# Altium project LSP_PCB_Project.PrjPCB
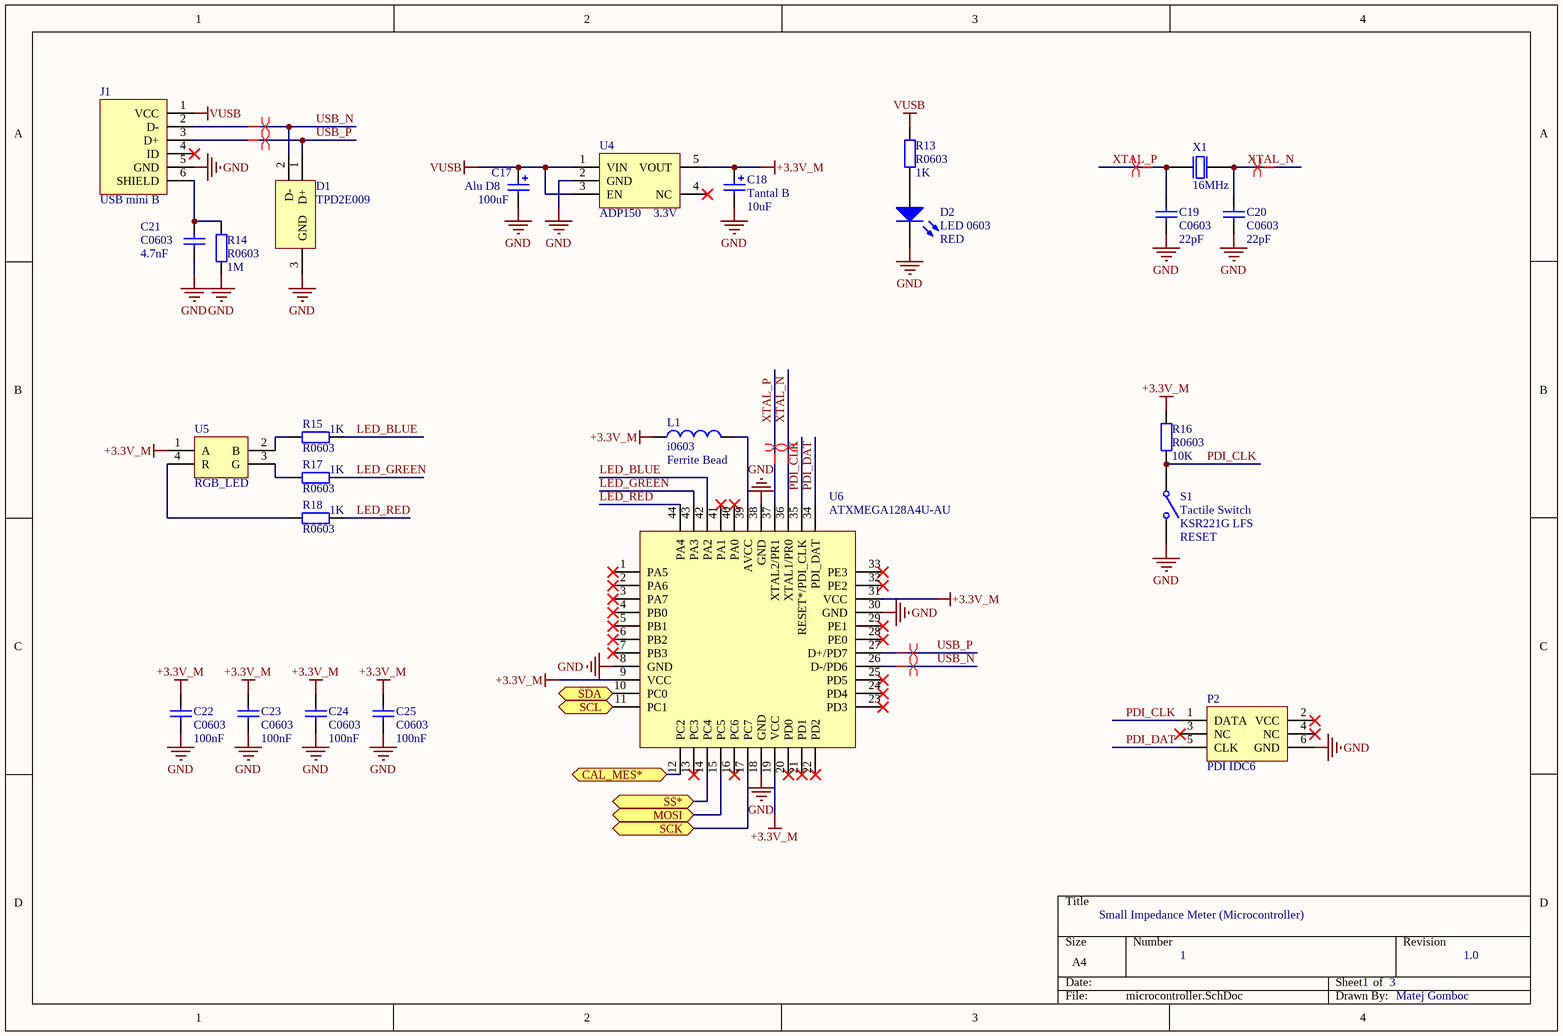
[diagram p0: microcontroller.SchDoc]
3 sheets, 65 parts. Net scope: flat (ports and power ports of the same name join across sheets).
Board file: PCB1.PcbDoc
Sheets:
  microcontroller.SchDoc
  analog.SchDoc
  clk_gen.SchDoc

## Sheet microcontroller.SchDoc: Small Impedance Meter (Microcontroller)
size A4; ApprovedBy: Matej Gomboc; CheckedBy: Matej Gomboc; Author: Matej Gomboc; DrawnBy: Matej Gomboc; Engineer: Matej Gomboc; DocumentNumber: 1; Revision: 1.0; SheetNumber: 1; SheetTotal: 3; DocumentName: Microcontroller; ProjectName: Small Impedance Meter

### Parts
C17  Alu D8  value 100uF  [PANASONIC SIZE D8]
C18  Tantal B  value 10uF  [AVX-CAPC3528_V]
C19  C0603  value 22pF  [0603_HandSoldering]
C20  C0603  value 22pF  [0603_HandSoldering]
C21  C0603  value 4.7nF  [0603_HandSoldering]
C22  C0603  value 100nF  [0603_HandSoldering]
C23  C0603  value 100nF  [0603_HandSoldering]
C24  C0603  value 100nF  [0603_HandSoldering]
C25  C0603  value 100nF  [0603_HandSoldering]
D1  TPD2E009  [TPD2E009_SOT23_3]
D2  LED 0603  value RED  [0603_LED]
J1  USB mini B  [USB mini B receptacle]
L1  i0603  value Ferrite Bead  [0603_HandSoldering]
P2  PDI IDC6  [PDI_HDR2X3]
R13  R0603  value 1K  [0603_HandSoldering]
R14  R0603  value 1M  [0603_HandSoldering]
R15  R0603  value 1K  [0603_HandSoldering]
R16  R0603  value 10K  [0603_HandSoldering]
R17  R0603  value 1K  [0603_HandSoldering]
R18  R0603  value 1K  [0603_HandSoldering]
S1  Tactile Switch  value KSR221G LFS  Note: RESET  [KSR221G_LFS_Tactile_Switch]
U4  ADP150  value 3.3V  [ADP150]
U5  RGB_LED  [PLCC-4_LED]
U6  ATXMEGA128A4U-AU  [ATXMEGAA4U_TQFP44]
X1  16MHz  [XTAL_TH_LOW]

### Ports
CAL_MES*, MOSI, SCK, SCL, SDA, SS*

### Nets
+3.3V_M: C18.1 C22.1 C23.1 C24.1 C25.1 L1.1 R16.2 U4.5(VOUT) U5.1(A) U6.9(VCC) U6.19(VCC) U6.31(VCC)
GND: C17.2 C18.2 C19.1 C20.1 C21.1 C22.2 C23.2 C24.2 C25.2 D1.3(GND) D2.2(K) J1.5(GND) P2.6(GND) R14.1 S1.2(NO) U4.2(GND) U6.8(GND) U6.18(GND) U6.30(GND) U6.38(GND)
VUSB: C17.1 J1.1(VCC) R13.1 U4.1(VIN) U4.3(EN)
LED_BLUE: R15.2 U6.42(PA2)
LED_GREEN: R17.1 U6.43(PA3)
LED_RED: R18.1 U6.44(PA4)
PDI_CLK: P2.1(DATA) R16.1 S1.1(COMMON) U6.35(RESET*/PDI_CLK)
PDI_DAT: P2.5(CLK) U6.34(PDI_DAT)
USB_N: D1.2(D-) J1.2(D-) U6.26(D-/PD6)
USB_P: D1.1(D+) J1.3(D+) U6.27(D+/PD7)
XTAL_N: C20.2 U6.36(XTAL1/PR0) X1.2(out)
XTAL_P: C19.2 U6.37(XTAL2/PR1) X1.1(inp)
NetC21_2: C21.2 J1.6(SHIELD) R14.2
NetD2_1: D2.1(A) R13.2
NetL1_2: L1.2 U6.39(AVCC)
NetR1_1: U6.11(PC1) ; port SCL
NetR2_1: U6.10(PC0) ; port SDA
NetR15_1: R15.1 U5.2(B)
NetR17_2: R17.2 U5.3(G)
NetR18_2: R18.2 U5.4(R)
NetU3_1: U6.12(PC2) ; port CAL_MES*
NetU6_14: U6.14(PC4) ; port SS*
NetU6_15: U6.15(PC5) ; port MOSI
NetU6_17: U6.17(PC7) ; port SCK

Not connected (* = marked no-connect by the designer): J1 4(ID)*; P2 2(VCC)* 3(NC)* 4(NC)*; U4 4(NC)*; U6 1(PA5)* 2(PA6)* 3(PA7)* 4(PB0)* 5(PB1)* 6(PB2)* 7(PB3)* 13(PC3)* 16(PC6)* 20(PD0)* 21(PD1)* 22(PD2)* 23(PD3)* 24(PD4)* 25(PD5)* 28(PE0)* 29(PE1)* 32(PE2)* 33(PE3)* 40(PA0)* 41(PA1)*

### Layout directives
differential pair: USB_N, USB_P, XTAL_N, XTAL_P

### Library data of the parts
C17 = Capacitor Aluminium: Aluminium Electrolythic Capacitor
C18 = Capacitor Tantalum: Tantalum Capacitor
C19-C25 = Capacitor: Ceramic Capacitor
D1 = TPD2E009: ESD protection
D2 = LED: SMD LED 0603
J1 = USB_mini_B: USB 2.0 mini B receptacle
L1 = Inductor
P2 = PDI_Header: PDI Programming Interface
R13-R18 = Resistor
S1 = SW-SPST: KSR221G LFS Tactile Switch
U4 = ADP150: 100 mA Voltage Regulator
U5 = RGB_LED: RGB LED ASMB-MTB0-0A3A2
U6 = ATXMEGA128A4U-AU: 8/16-bit Atmel XMEGA Microcontroller
X1 = XTAL_TH_LOW: XTAL TH Low Profile; Value: 16MHz

## Sheet analog.SchDoc: Small Impedance Meter (Analogue Part)
size A4; ApprovedBy: Matej Gomboc; CheckedBy: Matej Gomboc; Author: Matej Gomboc; DrawnBy: Matej Gomboc; Engineer: Matej Gomboc; DocumentNumber: 2; Revision: 1.0; SheetNumber: 2; SheetTotal: 3; DocumentName: Analogue Part; ProjectName: Small Impedance Meter
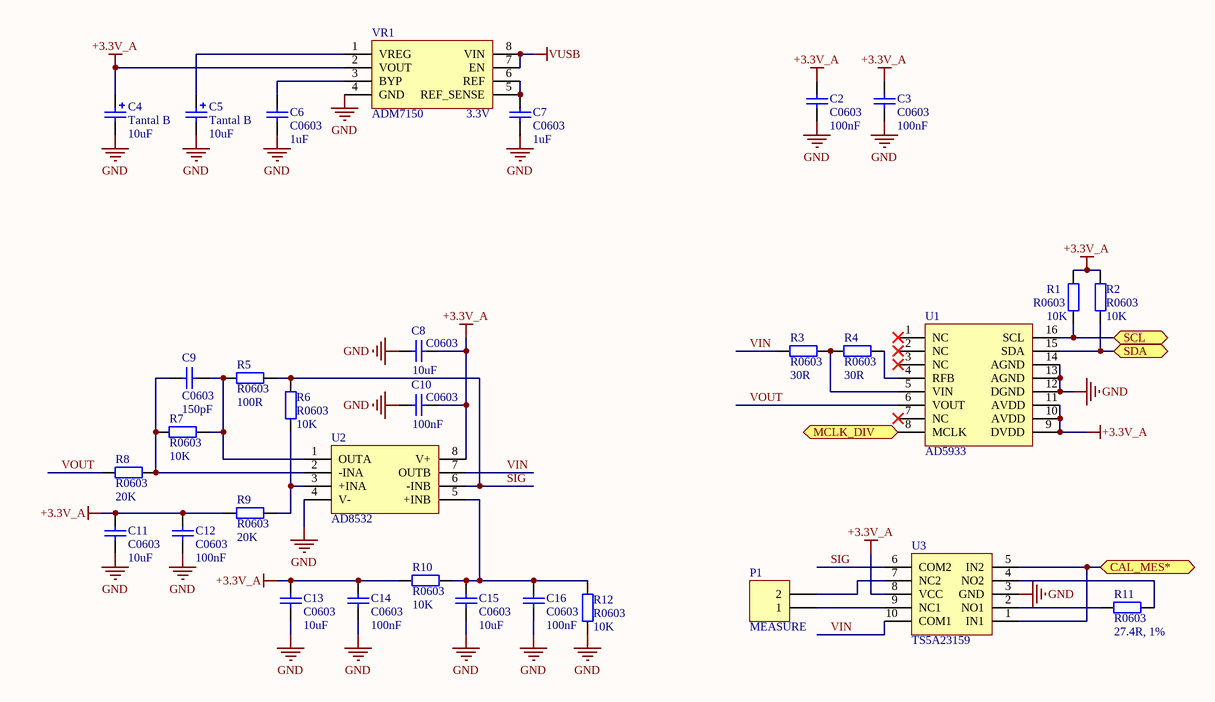
[diagram p1: analog.SchDoc]

### Parts
C2  C0603  value 100nF  [0603_HandSoldering]
C3  C0603  value 100nF  [0603_HandSoldering]
C4  Tantal B  value 10uF  [AVX-CAPC3528_V]
C5  Tantal B  value 10uF  [AVX-CAPC3528_V]
C6  C0603  value 1uF  [0603_HandSoldering]
C7  C0603  value 1uF  [0603_HandSoldering]
C8  C0603  value 10uF  [0603_HandSoldering]
C9  C0603  value 150pF  [0603_HandSoldering]
C10  C0603  value 100nF  [0603_HandSoldering]
C11  C0603  value 10uF  [0603_HandSoldering]
C12  C0603  value 100nF  [0603_HandSoldering]
C13  C0603  value 10uF  [0603_HandSoldering]
C14  C0603  value 100nF  [0603_HandSoldering]
C15  C0603  value 10uF  [0603_HandSoldering]
C16  C0603  value 100nF  [0603_HandSoldering]
P1  MEASURE  [HDR1X2]
R1  R0603  value 10K  [0603_HandSoldering]
R2  R0603  value 10K  [0603_HandSoldering]
R3  R0603  value 30R  [0603_HandSoldering]
R4  R0603  value 30R  [0603_HandSoldering]
R5  R0603  value 100R  [0603_HandSoldering]
R6  R0603  value 10K  [0603_HandSoldering]
R7  R0603  value 10K  [0603_HandSoldering]
R8  R0603  value 20K  [0603_HandSoldering]
R9  R0603  value 20K  [0603_HandSoldering]
R10  R0603  value 10K  [0603_HandSoldering]
R11  R0603  value 27.4R, 1%  [0603_HandSoldering]
R12  R0603  value 10K  [0603_HandSoldering]
U1  AD5933  [AD5933]
U2  AD8532  [AD8532_MSOP8]
U3  TS5A23159  [TS5A23159_VSSOP10]
VR1  ADM7150  value 3.3V  [ADM7150_SOIC8]

### Ports
CAL_MES*, MCLK_DIV, SCL, SDA

### Nets
+3.3V_A: C2.1 C3.1 C4.1 C8.1 C10.1 C11.2 C12.2 C13.2 C14.2 R1.2 R2.2 R9.2 R10.2 U1.9(DVDD) U1.10(AVDD) U1.11(AVDD) U2.8(V+) U3.8(VCC) VR1.2(VOUT)
GND: C2.2 C3.2 C4.2 C5.2 C6.1 C7.1 C8.2 C10.2 C11.1 C12.1 C13.1 C14.1 C15.1 C16.1 R12.1 U1.12(DGND) U1.13(AGND) U1.14(AGND) U2.4(V-) U3.3(GND) VR1.4(GND)
VUSB: VR1.7(EN) VR1.8(VIN)
SIG: R5.2 R6.2 U2.6(-INB) U3.6(COM2)
VIN: R3.2 U2.7(OUTB) U3.10(COM1)
VOUT: R8.1 U1.6(VOUT)
NetC5_1: C5.1 VR1.1(VREG)
NetC6_2: C6.2 VR1.3(BYP)
NetC7_2: C7.2 VR1.5(REF_SENSE) VR1.6(REF)
NetC9_1: C9.1 R7.1 R8.2 U2.2(-INA)
NetC9_2: C9.2 R5.1 R7.2 U2.1(OUTA)
NetC15_2: C15.2 C16.2 R10.1 R12.2 U2.5(+INB)
NetP1_1: P1.1 U3.9(NC1)
NetP1_2: P1.2 U3.7(NC2)
NetR1_1: R1.1 U1.16(SCL) ; port SCL
NetR2_1: R2.1 U1.15(SDA) ; port SDA
NetR3_1: R3.1 R4.2 U1.5(VIN)
NetR4_1: R4.1 U1.4(RFB)
NetR6_1: R6.1 R9.1 U2.3(+INA)
NetR11_1: R11.1 U3.2(NO1)
NetR11_2: R11.2 U3.4(NO2)
NetU1_8: U1.8(MCLK) ; port MCLK_DIV
NetU3_1: U3.1(IN1) U3.5(IN2) ; port CAL_MES*

Not connected (* = marked no-connect by the designer): U1 1(NC)* 2(NC)* 3(NC)* 7(NC)*

### Library data of the parts
C2 C3 C6-C16 = Capacitor: Ceramic Capacitor
C4 C5 = Capacitor Tantalum: Tantalum Capacitor
P1 = Header 2: Header, 2-Pin
R1-R12 = Resistor
U1 = AD5933: Network Analyzer
U2 = AD8532: High Current Output OpAmp
U3 = TS5A23159: 2-Channel SPDT Switch
VR1 = ADM7150: 800 mA Ultralow Noise,  High PSRR, RF Linear Regulator

## Sheet clk_gen.SchDoc: Small Impedance Meter (Clock Generator)
size A4; ApprovedBy: Matej Gomboc; CheckedBy: Matej Gomboc; Author: Matej Gomboc; DrawnBy: Matej Gomboc; Engineer: Matej Gomboc; DocumentNumber: 3; Revision: 1.0; SheetNumber: 3; SheetTotal: 3; DocumentName: Clock Generator; ProjectName: Small Impedance Meter
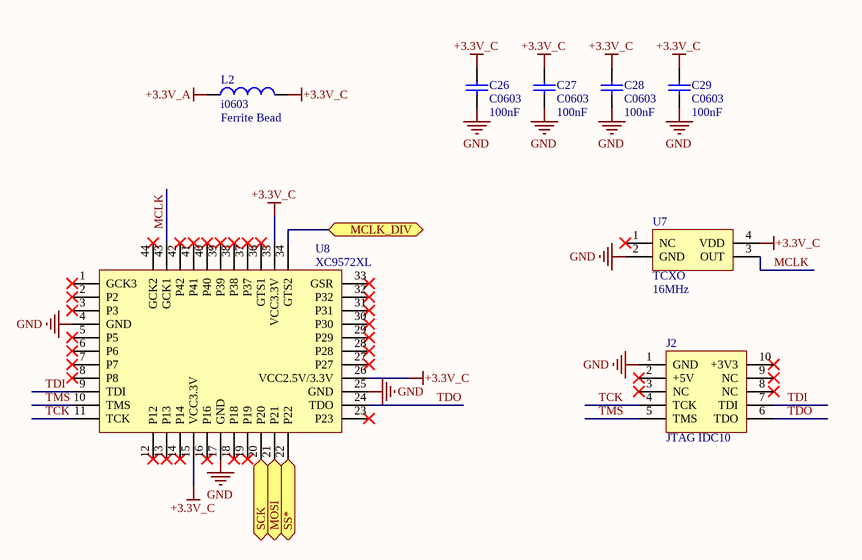
[diagram p2: clk_gen.SchDoc]

### Parts
C26  C0603  value 100nF  [0603_HandSoldering]
C27  C0603  value 100nF  [0603_HandSoldering]
C28  C0603  value 100nF  [0603_HandSoldering]
C29  C0603  value 100nF  [0603_HandSoldering]
J2  JTAG IDC10  [IDC10]
L2  i0603  value Ferrite Bead  [0603_HandSoldering]
U7  TCXO  value 16MHz  [TCXO_5x3]
U8  XC9572XL  [XC9572XL_QFP44]

### Ports
MCLK_DIV, MOSI, SCK, SS*

### Nets
+3.3V_A: L2.1
+3.3V_C: C26.1 C27.1 C28.1 C29.1 L2.2 U7.4(VDD) U8.15(VCC3.3V) U8.26(VCC2.5V/3.3V) U8.35(VCC3.3V)
GND: C26.2 C27.2 C28.2 C29.2 J2.1(GND) U7.2(GND) U8.4(GND) U8.17(GND) U8.25(GND)
MCLK: U7.3(OUT) U8.43(GCK1)
TCK: J2.4(TCK) U8.11(TCK)
TDI: J2.7(TDI) U8.9(TDI)
TDO: J2.6(TDO) U8.24(TDO)
TMS: J2.5(TMS) U8.10(TMS)
NetU1_8: U8.34(GTS2) ; port MCLK_DIV
NetU6_14: U8.22(P22) ; port SS*
NetU6_15: U8.21(P21) ; port MOSI
NetU6_17: U8.20(P20) ; port SCK

Not connected (* = marked no-connect by the designer): J2 2(+5V)* 3(NC)* 8(NC)* 9(NC)* 10(+3V3)*; U7 1(NC)*; U8 1(GCK3)* 2(P2)* 3(P3)* 5(P5)* 6(P6)* 7(P7)* 8(P8)* 12(P12)* 13(P13)* 14(P14)* 16(P16)* 18(P18)* 19(P19)* 23(P23)* 27(P27)* 28(P28)* 29(P29)* 30(P30)* 31(P31)* 32(P32)* 33(GSR)* 36(GTS1)* 37(P37)* 38(P38)* 39(P39)* 40(P40)* 41(P41)* 42(P42)* 44(GCK2)*

### Library data of the parts
C26-C29 = Capacitor: Ceramic Capacitor
J2 = JTAG_IDC10: JTAG IDC10 Bus Pirate Programming Interface
L2 = Inductor
U7 = TCXO: FOX924B-16.000  TCXO, 3.3V CMOS, SMD
U8 = XC9572XL: Xilinx CPLD 72 Macrocells

## Nets that join several sheets
+3.3V_A: analog (19 pins), clk_gen (L2.1)
GND: microcontroller (20 pins), analog (21 pins), clk_gen (9 pins)
VUSB: microcontroller (5 pins), analog (VR1.7 VR1.8)
NetR1_1: microcontroller (U6.11), analog (R1.1 U1.16)
NetR2_1: microcontroller (U6.10), analog (R2.1 U1.15)
NetU1_8: analog (U1.8), clk_gen (U8.34)
NetU3_1: microcontroller (U6.12), analog (U3.1 U3.5)
NetU6_14: microcontroller (U6.14), clk_gen (U8.22)
NetU6_15: microcontroller (U6.15), clk_gen (U8.21)
NetU6_17: microcontroller (U6.17), clk_gen (U8.20)